# Altium schematic sheet Schematic02.SchDoc
size A; SheetNumber: 1; SheetTotal: 1
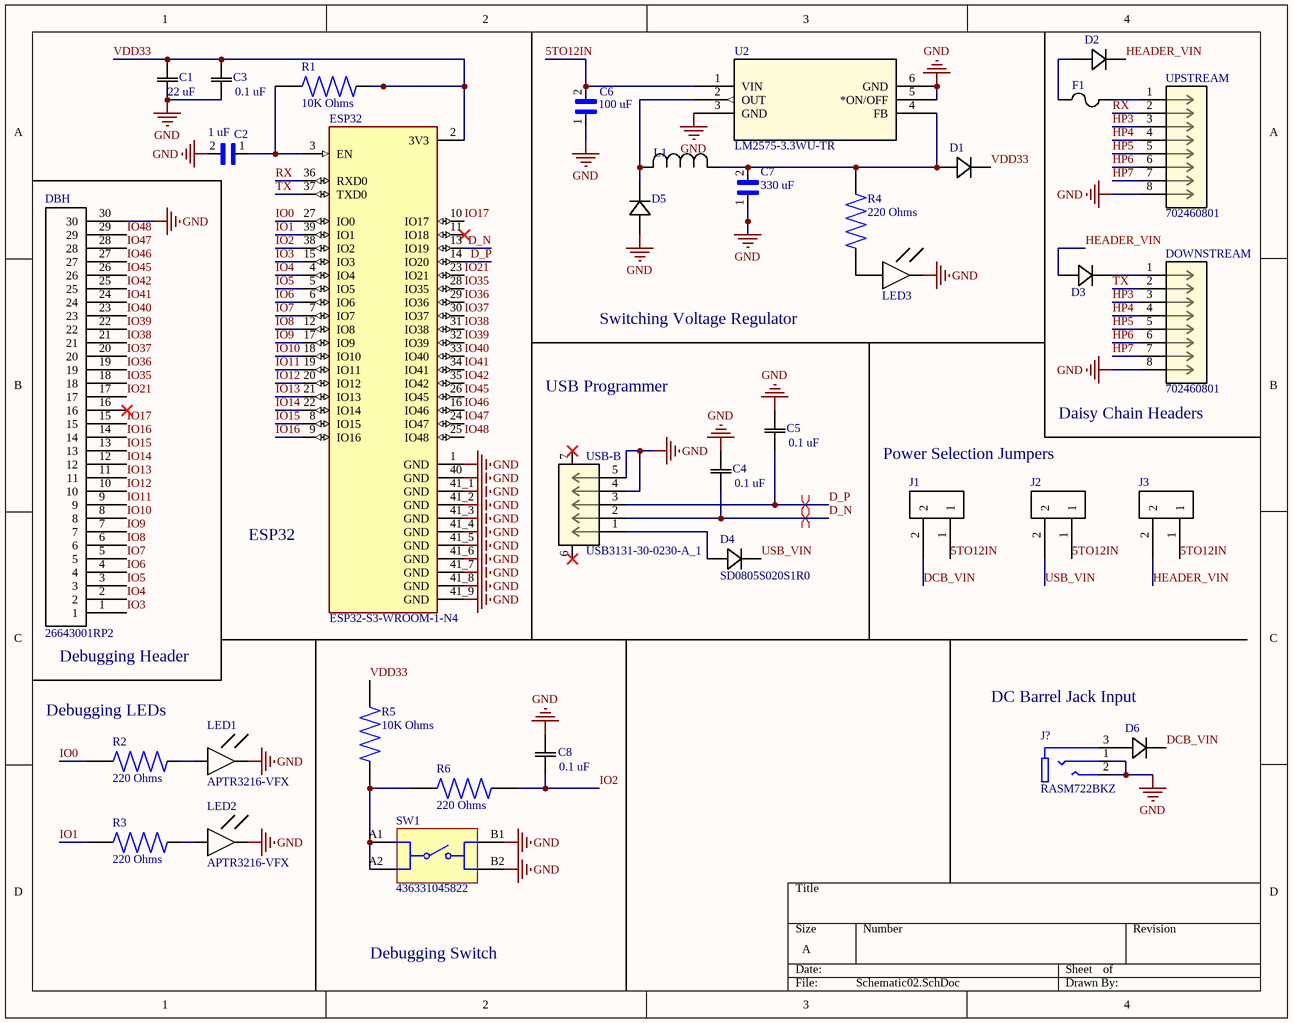
[diagram p0: Schematic02.SchDoc]

## Parts
C1  value 22 uF  [CAP_CL_21_SAM]  (hidden comment: CL21A226MAYNNNE)
C2  value 1 uF  [CAPC2012X140N]  (hidden comment: CL21B105KBFNNNE)
C3  value 0.1 uF  [CAPC2012X06N]  (hidden comment: THISONE08053C104KAT2A)
C4  value 0.1 uF  [CAPC2012X06N]  (hidden comment: THISONE08053C104KAT2A)
C5  value 0.1 uF  [CAPC2012X06N]  (hidden comment: THISONE08053C104KAT2A)
C6  value 100 uF  [CAPC3216X190N]  (hidden comment: GRM31CR61A107MEA8L)
C7  value 330 uF  [CAPC3225X280N]  (hidden comment: JMK325ABJ337MM-PE)
C8  value 0.1 uF  [CAPC2012X06N]  (hidden comment: THISONE08053C104KAT2A)
D1  SD0805S020S1R0  [SD0805_AVX]  (value not drawn)
D2  SD0805S020S1R0  [SD0805_AVX]  (value not drawn)
D3  SD0805S020S1R0  [SD0805_AVX]  (value not drawn)
D4  SD0805S020S1R0  [SD0805_AVX]
D5  SD0805S020S1R0  [SD0805_AVX]  (value not drawn)
D6  SD0805S020S1R0  [SD0805_AVX]  (value not drawn)
DBH  26643001RP2  [26643001RP2-Footprint-1]
DOWNSTREAM  702460801  [CONN_7024608xx_MOL]
ESP32  ESP32-S3-WROOM-1-N4  [XCVR_ESP32-S3-WROOM-1-N4]
F1  0154.630DR  [0154Series_LTF]  (value not drawn)
J1  2x1JUMPER  [26640201RP2-Footprint-1]  (value not drawn)
J2  2x1JUMPER  [26640201RP2-Footprint-1]  (value not drawn)
J3  2x1JUMPER  [26640201RP2-Footprint-1]  (value not drawn)
J?  RASM722BKZ  [SWITCHCRAFT_RASM722BKZ]
L1  NR10050T221M  [INDP10198X50N]  (value not drawn)
LED1  APTR3216-VFX  [SODFL350X110-2N]
LED2  APTR3216-VFX  [SODFL350X110-2N]
LED3  APTR3216-VFX  [SODFL350X110-2N]  (value not drawn)
R1  10K Ohms  [RESC3116X65N]
R2  220 Ohms  [RESC2012X65N]
R3  220 Ohms  [RESC2012X65N]
R4  220 Ohms  [RESC2012X65N]
R5  10K Ohms  [RESC3116X65N]
R6  220 Ohms  [RESC2012X65N]
SW1  436331045822  [436331045822]
U2  LM2575-3.3WU-TR  [DPAK183P1580X460-6N]
UPSTREAM  702460801  [CONN_7024608xx_MOL]
USB-B  USB3131-30-0230-A_1  [USB3131-30-0230-A_1-Footprint-1]

## Nets
GND: C1.1 C2.2 C3.1 C4.2 C5.2 C6.1 C7.1 C8.1 D5.2 DBH.30 DOWNSTREAM.8 ESP32.1(GND) ESP32.40(GND) ESP32.41_1(GND) ESP32.41_2(GND) ESP32.41_3(GND) ESP32.41_4(GND) ESP32.41_5(GND) ESP32.41_6(GND) ESP32.41_7(GND) ESP32.41_8(GND) ESP32.41_9(GND) J?.1(SHUNT) J?.2(TIP) LED1.1 LED2.1 LED3.1 SW1.B1 SW1.B2 U2.3(GND) U2.5(*ON/OFF) U2.6(GND) UPSTREAM.8 USB-B.4 USB-B.5
5TO12IN: C6.2 J1.1 J2.1 J3.1 U2.1(VIN)
D_N: C4.1 ESP32.13(IO19) USB-B.2
D_P: C5.1 ESP32.14(IO20) USB-B.3
DCB_VIN: D6.1 J1.2
HEADER_VIN: D2.1 D3.2 J3.2
HP3: DOWNSTREAM.3 UPSTREAM.3
HP4: DOWNSTREAM.4 UPSTREAM.4
HP5: DOWNSTREAM.5 UPSTREAM.5
HP6: DOWNSTREAM.6 UPSTREAM.6
HP7: DOWNSTREAM.7 UPSTREAM.7
IO0: ESP32.27(IO0) R2.1
IO1: ESP32.39(IO1) R3.1
IO2: C8.2 ESP32.38(IO2) R6.2
IO3: DBH.1 ESP32.15(IO3)
IO4: DBH.2 ESP32.4(IO4)
IO5: DBH.3 ESP32.5(IO5)
IO6: DBH.4 ESP32.6(IO6)
IO7: DBH.5 ESP32.7(IO7)
IO8: DBH.6 ESP32.12(IO8)
IO9: DBH.7 ESP32.17(IO9)
IO10: DBH.8 ESP32.18(IO10)
IO11: DBH.9 ESP32.19(IO11)
IO12: DBH.10 ESP32.20(IO12)
IO13: DBH.11 ESP32.21(IO13)
IO14: DBH.12 ESP32.22(IO14)
IO15: DBH.13 ESP32.8(IO15)
IO16: DBH.14 ESP32.9(IO16)
IO17: DBH.15 ESP32.10(IO17)
IO21: DBH.17 ESP32.23(IO21)
IO35: DBH.18 ESP32.28(IO35)
IO36: DBH.19 ESP32.29(IO36)
IO37: DBH.20 ESP32.30(IO37)
IO38: DBH.21 ESP32.31(IO38)
IO39: DBH.22 ESP32.32(IO39)
IO40: DBH.23 ESP32.33(IO40)
IO41: DBH.24 ESP32.34(IO41)
IO42: DBH.25 ESP32.35(IO42)
IO45: DBH.26 ESP32.26(IO45)
IO46: DBH.27 ESP32.16(IO46)
IO47: DBH.28 ESP32.24(IO47)
IO48: DBH.29 ESP32.25(IO48)
RX: ESP32.36(RXD0) UPSTREAM.2
TX: DOWNSTREAM.2 ESP32.37(TXD0)
USB_VIN: D4.1 J2.2
VDD33: C1.2 C3.2 D1.1 ESP32.2(3V3) R1.2 R5.2
NetC2_1: C2.1 ESP32.3(EN) R1.1
NetC7_2: C7.2 D1.2 L1.1 R4.2 U2.4(FB)
NetD2_2: D2.2 F1.1
NetD3_1: D3.1 DOWNSTREAM.1
NetD4_2: D4.2 USB-B.1
NetD5_1: D5.1 L1.2 U2.2(OUT)
NetD6_2: D6.2 J?.3(SLEEVE)
NetF1_2: F1.2 UPSTREAM.1
NetLED1_2: LED1.2 R2.2
NetLED2_2: LED2.2 R3.2
NetLED3_2: LED3.2 R4.1
NetR5_1: R5.1 R6.1 SW1.A1 SW1.A2

Not connected (* = marked no-connect by the designer): DBH 16*; ESP32 11(IO18)*; USB-B 6* 7*

## Layout directives
differential pair: D_N, D_P

## Notes on the sheet
- Switching Voltage Regulator
- USB Programmer
- (near DOWNSTREAM) Daisy Chain Headers
- Power Selection Jumpers
- (near ESP32) ESP32
- (near DBH) Debugging Header
- DC Barrel Jack Input
- Debugging LEDs
- Debugging Switch

## Library data of the parts
C1 = CMP-017-000005-2: No Description Available; Mfr_Name: Samsung; Pin Count: 2; Design Item ID: CL21A226MAYNNNE; Source: CL21A226MAYNNNE.SchLib; Component Type: Standard
C2 = CMP-017-000007-1: 1ÂµF Â±10% 50V Ceramic Capacitor X7R 0805 _2012 Metric_; MF: Samsung; Pin Count: 2; Design Item ID: CL21B105KBFNNNE; Source: SnapEDAsch.SchLib; Component Type: Standard; SnapEDA_Link: https://www.snapeda.com/parts/CL21B105KBFNNNE/Samsung/view-part/3598744/?ref=snap; Availability: Unavailable; Price: None; Package: 0805 Samsung; MP: CL21B105KBFNNNE
C3-C5 C8 = CMP-017-000003-3: No Description Available; Mfr_Name: KYOCERA AVX; Pin Count: 2; Design Item ID: 08053C104KAT2A; Source: 08053C104KAT2A.SchLib; Component Type: Standard
C6 = CMP-017-000006-1: Availability: Unavailable; Pin Count: 2; Price: None; Source: GRM31CR61A107MEA8L.SchLib; Package: None; MP: GRM31CR61A107MEA8L; Component Type: Standard; Design Item ID: GRM31CR61A107MEA8L
C7 = CMP-017-000008-1: 330ÂµF Â±20% 6.3V Ceramic Capacitor X5R 1210 (3225 Metric); MF: Taiyo Yuden; Digi-Key_Part_Number: 587-6443-1-ND; Mouser-Purchase-URL: https://snapeda.com/shop?store=Mouser&id=3658173; Component Type: Standard; SnapEDA_Link: https://www.snapeda.com/parts/JMK325ABJ337MM-PE/Taiyo%20Yuden/view-part/3658173/?ref=snap; Design Item ID: JMK325ABJ337MM-PE; Source: JMK325ABJ337MM-PE.SchLib; MP: JMK325ABJ337MM-PE; Package: 3225 Taiyo Yuden; Pin Count: 2
D1-D6 = CMP-024-000001-3: No Description Available; Mfr_Name: KYOCERA AVX; Design Item ID: SD0805S020S1R0; Source: SD0805S020S1R0.SchLib
DBH = CMP-00006-3: Board Connector
DOWNSTREAM UPSTREAM = CMP-004-000000-1: No Description Available; Mfr_Name: Molex Connector Corporation; RefDes: RefDes; Pin Count: 8; Component Type: Standard; Source: 702460801.SchLib; Design Item ID: 702460801; Type: Type
ESP32 = CMP-006-000000-1: MF: {'manufacturer': u'Espressif Systems'}; Availability: Unavailable; Package: None; Price: None; MP: ESP32-S3-WROOM-1-N4; Value: *; Component Type: Standard; Pin Count: 49; Design Item ID: ESP32-S3-WROOM-1-N4; Source: ESP32-S3-WROOM-1-N4.SchLib
F1 = CMP-010-000000-2: No Description Available; Mfr_Name: Littelfuse Inc; Pin Count: 2; Source: 0154P630DR.SchLib; Design Item ID: 0154.630DR; Component Type: Standard
J1-J3 = CMP-00005-3: Board Connector
J? = CMP-020-000000-1: MF: Switchcraft Inc.; Value: *; Availability: Unavailable; Price: None; Package: None; Pin Count: 3; MP: RASM722BKZ; Design Item ID: RASM722BKZ; Source: RASM722BKZ.SchLib; Component Type: Standard
L1 = CMP-028-000000-2: No Description Available; Mfr_Name: Taiyo Yuden; Component Type: Standard; Pin Count: 2; Design Item ID: NR10050T221M; Source: NR10050T221M.SchLib
LED1-LED3 = CMP-00009-1: violet LED
R1 R5 = CMP-017-000000-1: 10 kOhms Â±1% 0.25W, 1/4W Chip Resistor 1206 (3216 Metric) Moisture Resistant Thick Film; MF: Yageo; Price: None; Value: *; Check_prices: https://www.snapeda.com/parts/RC1206FR-0710KL/Yageo/view-part/?ref=eda; Package: 3116 Yageo; Pin Count: 2; Design Item ID: RC1206FR-0710KL; MP: RC1206FR-0710KL; Availability: In Stock; Source: RC1206FR-0710KL.SchLib; SnapEDA_Link: https://www.snapeda.com/parts/RC1206FR-0710KL/Yageo/view-part/?ref=snap; Component Type: Standard; Purchase-URL: https://pricing.snapeda.com/search?q=RC1206FR-0710KL&ref=eda
R2-R4 R6 = CMP-017-000002-1: Fixed Resistor CRGCQ 0805 220R 1%; MF: TE Connectivity; Mouser-Purchase-URL: https://snapeda.com/shop?store=Mouser&id=3188284; SnapEDA_Link: https://www.snapeda.com/parts/CRGCQ0805F220R/TE%20Connectivity%20Passive%20Product/view-part/3188284/?ref=snap; MP: CRGCQ0805F220R; Component Type: Standard; Digi-Key_Part_Number: A129741CT-ND; Design Item ID: CRGCQ0805F220R; Pin Count: 2; Package: 2012 TE Connectivity; DigiKey-Purchase-URL: https://snapeda.com/shop?store=DigiKey&id=3188284; Value: *; Source: CRGCQ0805F220R.SchLib
SW1 = CMP-015-000006-1: WS-TASU SMT Tact Switch with Boss Design 4.7x3.5mm side push, SPST-NO, 12VDC, 50mA, 220g; Manufacturer: Wurth Elektronik; Washable: No; Operating Temperature Min: -40°C; ComponentLink1Description: Website Link; Operation Force: 220g; Rated Current: 50mA; Terminal Plating: Silver; ComponentLink1URL: https://www.we-online.com/redexpert/article/436331045822?ad; Contact Plating: Silver; Category: Tact Switches; Terminal Material: Copper Alloy; Height: 1.65mm; Source: WS-TASU.SchLib; ComponentLink2URL: https://www.we-online.com/redexpert/spec/436331045822?ad; Match Code: WS-TASU; Width: 3.5mm; Operating Temperature Max: 85°C; Mount: Surface Mount; Circuit: SPST-NO; Rated Voltage: 12VDC; Pin Count: 4; Design Item ID: 436331045822; Length: 4.7mm; Component Type: Standard; Manufacturer Part Number: 436331045822; Packaging: Tape and Reel; ComponentLink2Description: Datasheet Link; Contact Material: Stainless Steel
U2 = CMP-013-000001-2: No Description Available; Mfr_Name: Microchip; Design Item ID: LM2575-3.3WU-TR; Source: LM2575-3P3WU-TR.SchLib; Pin Count: 6; Component Type: Standard; Type: Type; RefDes: RefDes
USB-B = CMP-008-000002-2: No Description Available; Mfr_Name: Global Connector Technology; Pin Count: 5; Design Item ID: USB3131-30-0230-A_1; Component Type: Standard; Source: USB3131-30-0230-A.SchLib; RefDes: RefDes; Type: Type